# EAGLE design leicester_rev_A (EAGLE 6.6.0)
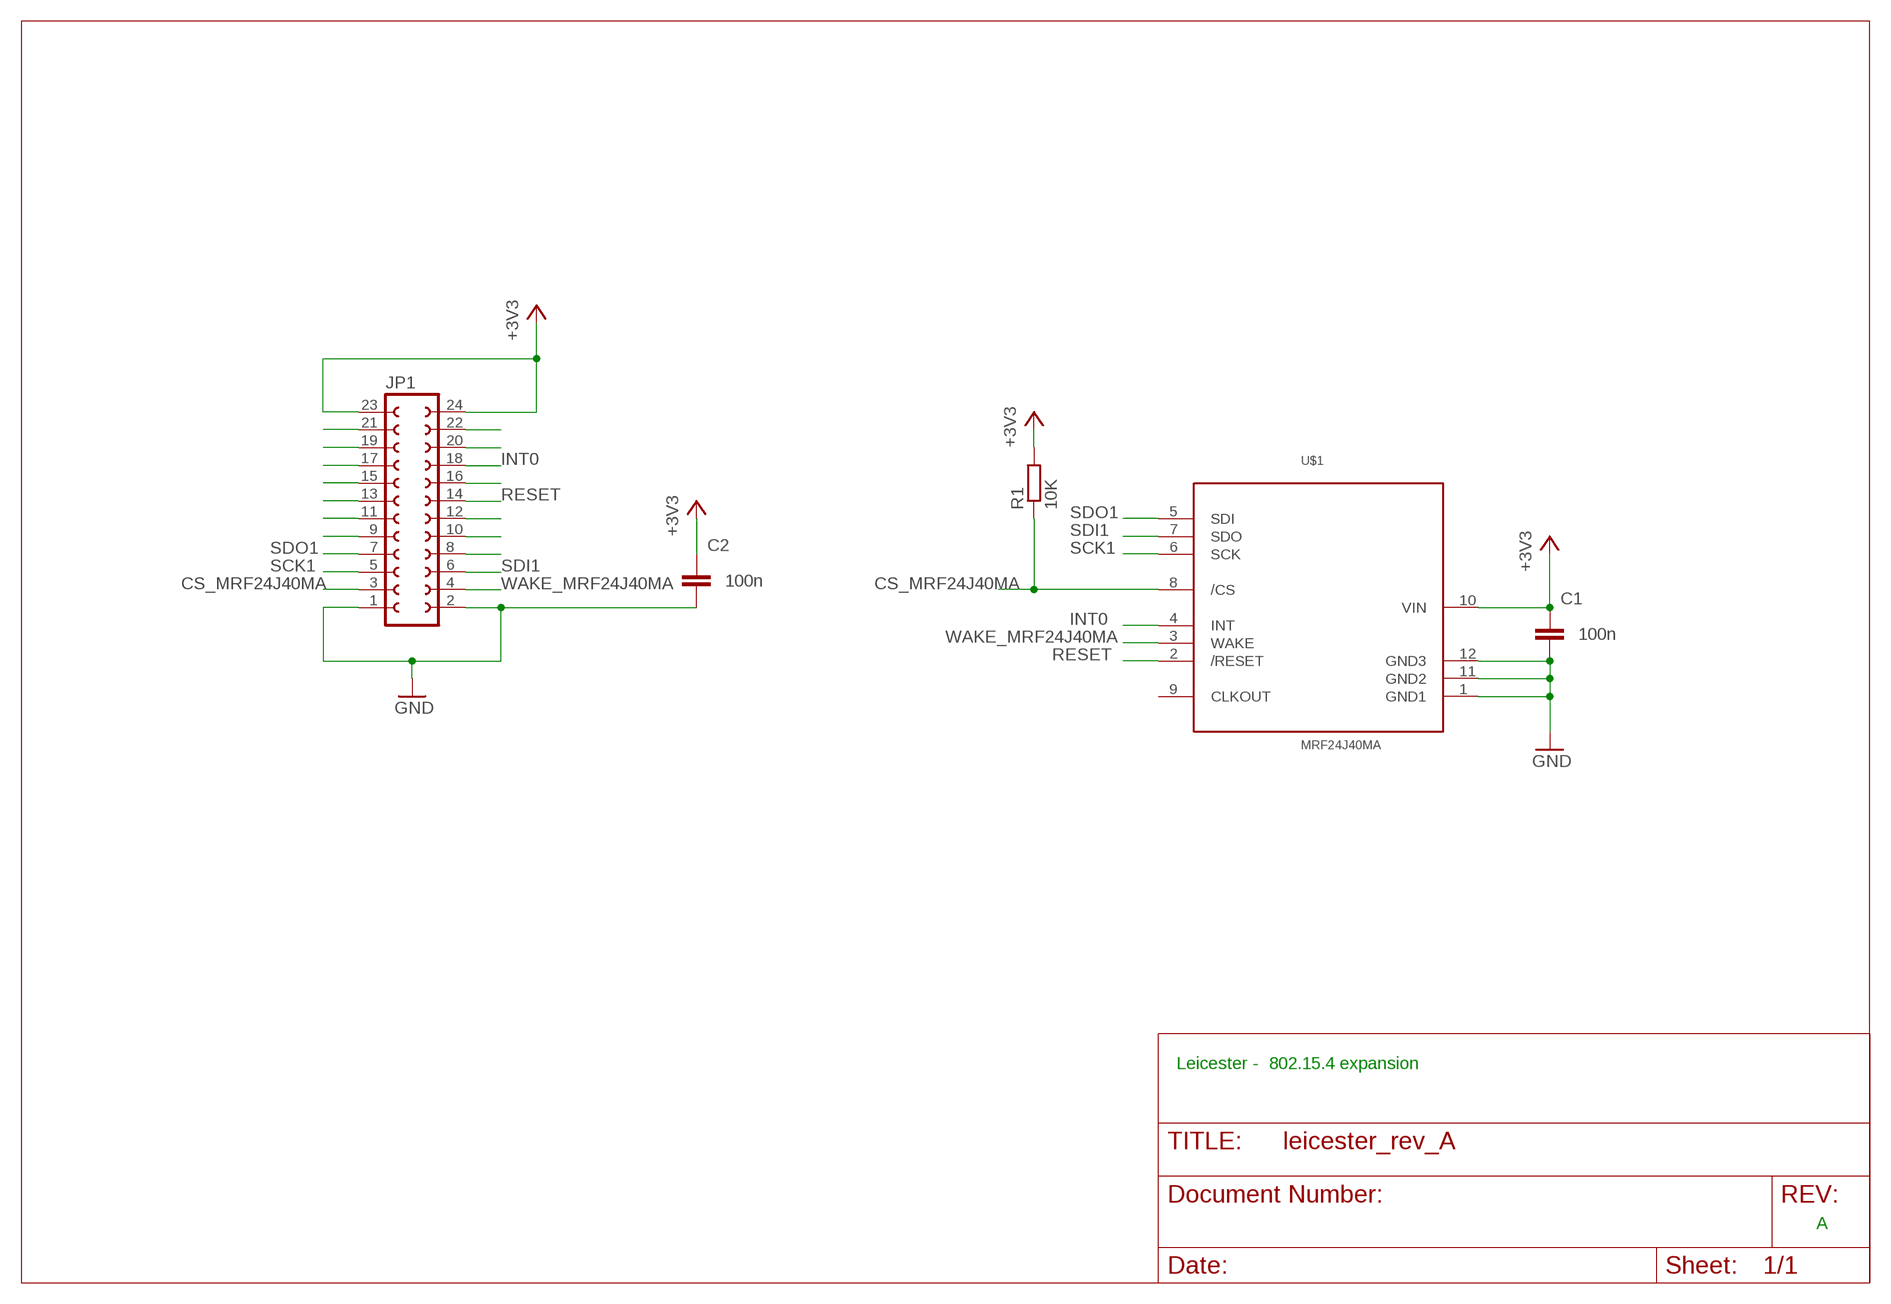
[diagram p0: schematic, sheet 1]

## Parts
C1  100n  C-EUC0805  [C0805]
C2  100n  C-EUC0805  [C0805]
JP1  FE12-2  [FE12-2]
R1  10K  R-EU_R0805  [R0805]
U$1  MRF24J40MA  [MRF24J40MA]

## Nets
+3V3: C1.1 C2.1 JP1.23 JP1.24 R1.2 U$1.10(VIN)
CS_MRF24J40MA: JP1.3 R1.1 U$1.8(/CS)
GND: C1.2 C2.2 JP1.1 JP1.2 U$1.1(GND1) U$1.11(GND2) U$1.12(GND3)
INT0: JP1.18 U$1.4(INT)
N$9: JP1.22
N$10: JP1.20
N$12: JP1.16
N$14: JP1.12
N$15: JP1.10
N$16: JP1.8
N$21: JP1.21
N$22: JP1.19
N$23: JP1.17
N$24: JP1.15
N$25: JP1.13
N$26: JP1.11
N$27: JP1.9
RESET: JP1.14 U$1.2(/RESET)
SCK1: JP1.5 U$1.6(SCK)
SDI1: JP1.6 U$1.7(SDO)
SDO1: JP1.7 U$1.5(SDI)
WAKE_MRF24J40MA: JP1.4 U$1.3(WAKE)
Unconnected: U$1.9(CLKOUT)

## Notes on the sheet
- Leicester -  802.15.4 expansion
- A

## Library data of the parts
C1 C2 = rcl:C-EU: CAPACITOR, European symbol
JP1 = con-lsta:FE12-2: FEMALE HEADER; OC_FARNELL: unknown; OC_NEWARK: unknown
R1 = rcl:R-EU_: RESISTOR, European symbol
U$1 = eurosource_mrf24j40ma:MRF24J40MA

## Board
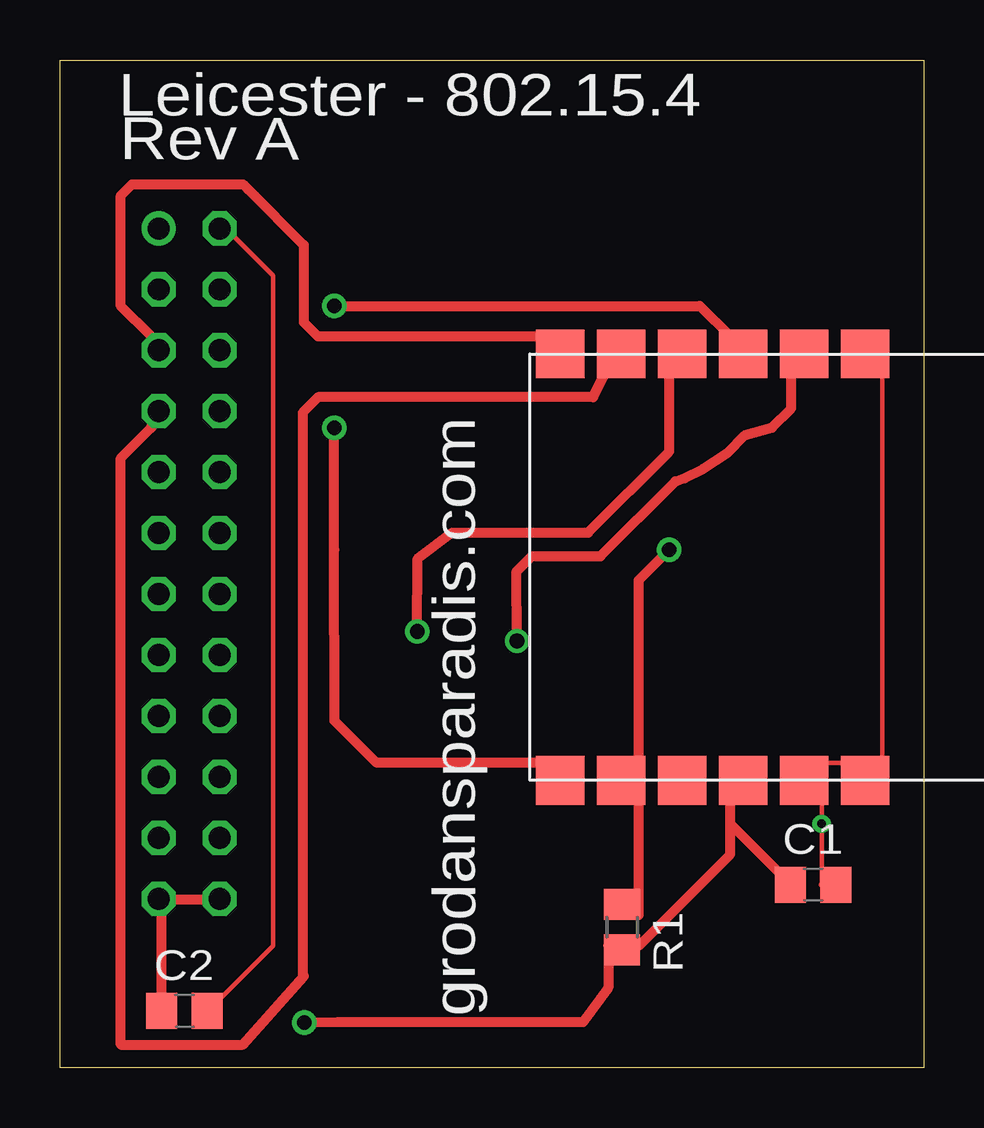
[diagram p1: board, top side]
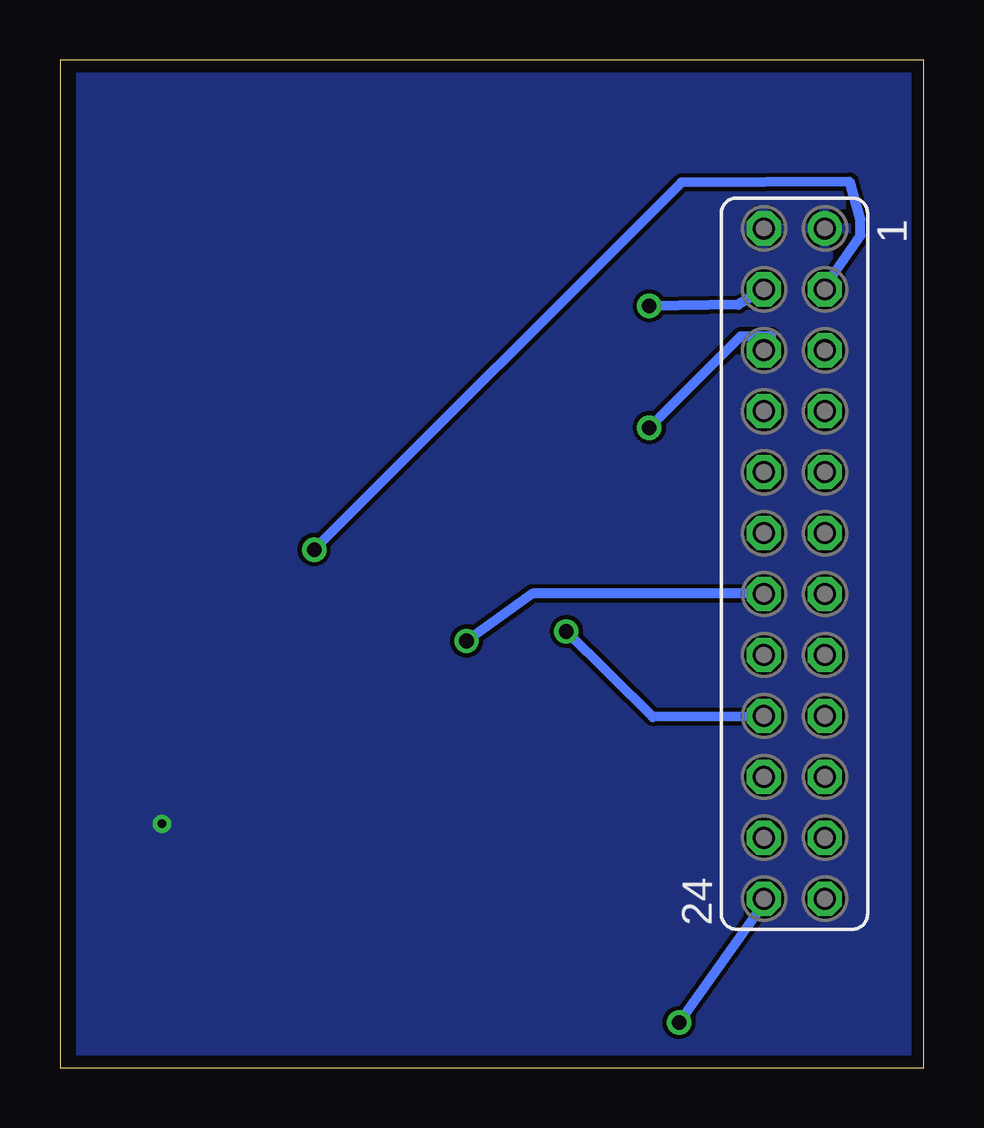
[diagram p2: board, bottom side, seen from below]

Size 36 x 42 mm. Coordinates in mm from the lower left corner, seen from the top.
Outline: 0,0 0,42 36,42 36,0 0,0
Copper layers (1*16): Top 0.0356mm / dielectric 1.5011mm / Bottom 0.0356mm
Design rules "SilverCircuits": minimum track width 7mil, minimum drill 14mil, track to track 7mil, track to pad 7mil, pad to pad 7mil, via to via 7mil, smd to smd 0mil, copper to edge 20mil, drill to drill 8mil, minimum pad ring 10mil, minimum via ring 8mil, stop-mask expansion 4mil, vias tented up to drill 0mil, thermal gap 10mil

### Footprints (pad centres in the part's own frame; a part is rotated, then mirrored left to right if it is on the bottom)
C0805 = smd 1.3 x 1.5: 1 -0.95,0; 2 0.95,0
FE12-2 = drill 0.914: 1 -13.97,1.27 | drill 0.914 octagon: 2 -13.97,-1.27; 3 -11.43,1.27; 4 -11.43,-1.27; 5 -8.89,1.27; 6 -8.89,-1.27; 7 -6.35,1.27; 8 -6.35,-1.27; 9 -3.81,1.27; 10 -3.81,-1.27; 11 -1.27,1.27; 12 -1.27,-1.27; 13 1.27,1.27; 14 1.27,-1.27; 15 3.81,1.27; 16 3.81,-1.27; 17 6.35,1.27; 18 6.35,-1.27; 19 8.89,1.27; 20 8.89,-1.27; 21 11.43,1.27; 22 11.43,-1.27; 23 13.97,1.27; 24 13.97,-1.27
R0805 = smd 1.3 x 1.5: 1 -0.95,0; 2 0.95,0
MRF24J40MA = smd 2.032 x 2.032: 1 -8.89,6.35; 2 -8.89,3.81; 3 -8.89,1.27; 4 -8.89,-1.27; 5 -8.89,-3.81; 6 -8.89,-6.35; 7 8.89,-6.35; 8 8.89,-3.81; 9 8.89,-1.27; 10 8.89,1.27; 11 8.89,3.81; 12 8.89,6.35

### Placement (x,y rotation side)
C1  31.4,7.62 0 top
C2  5.19,2.36 0 top
JP1  5.38,21.01 270 bottom
R1  23.43,5.85 270 top
U$1  27.21,20.86 270 top

### Tracks (layer width: path | path; a pad name or v marks a point on that pad's centre or on a via)
+3V3  (via drill 0.61)
  Top 0.254: 24.13,5.08 R1.2 22.86,5.08 | 27.94,11.43 U$1.10 | 30.48,7.62 C1.1
  Top 0.406: C2.1 4.24,7.04 JP1.23 4.12,7 6.67,7 JP1.24 | 24.13,5.08 27.94,8.89 27.94,10.16 | 27.94,10.16 27.94,11.43 | 27.94,10.16 30.48,7.62 | 22.86,5.08 22.86,3.33 21.81,1.89 11.58,1.89 v10.2,1.88
  Bottom 0.406: v10.2,1.88 6.56,6.98 JP1.24
CS_MRF24J40MA  (via drill 0.61)
  Top 0.254: R1.1 24.13,6.35 | 24.13,11.43 U$1.8 24.13,12.7
  Top 0.406: 24.13,6.35 24.13,11.43 | v25.4,21.59 24.13,20.32 24.13,12.7
  Bottom 0.406: v25.4,21.59 10.1,36.89 3.08,36.93 2.63,35.36 2.63,34.69 3.81,33.02 JP1.3
GND  (via drill 0.36)
  Top 0.178: 31.75,11.43 v31.75,10.16 31.75,7.62 | 33.02,12.7 31.75,12.7 | 34.29,12.7 34.29,29.21 | C2.2 6.35,2.54 8.89,5.08 8.89,33.02 6.35,35.56 JP1.2
  Top 0.254: 31.75,7.62 C1.2 | 31.75,11.43 U$1.11 31.75,12.7 | 33.02,12.7 U$1.12 34.29,12.7 | U$1.1 34.29,29.21
  pour Bottom: 0.28,41.29 0.25,41.29 0.25,0.08 34.33,0.39 35.37,0.54 35.11,0.62 35.11,42.52 0.51,42.07 0.51,40.95
INT0  (via drill 0.61)
  Top 0.254: 25.4,29.21 U$1.4
  Top 0.406: v14.89,18.18 14.91,21.21 16.34,22.3 22.02,22.3 25.4,25.68 25.4,29.21
  Bottom 0.406: v14.89,18.18 11.29,14.61 6.63,14.64 JP1.18
RESET  (via drill 0.61)
  Top 0.254: 30.48,29.21 U$1.2
  Top 0.406: v19.05,17.78 19.04,20.69 19.67,21.32 22.54,21.32 25.66,24.43 26.04,24.57 26.81,24.96 27.82,25.62 28.56,26.36 29.68,26.67 30.48,27.47 30.48,29.21
  Bottom 0.406: v19.05,17.78 16.3,19.76 6.59,19.76 JP1.14
SCK1
  Top 0.254: 7.62,36.83 7.84,36.61 | 20.32,30.48 U$1.6
  Top 0.406: JP1.5 3.81,30.48 2.54,31.75 2.54,36.35 3.01,36.82 7.63,36.82 7.84,36.61 10.16,34.29 10.16,31.07 10.74,30.49 20.31,30.49 20.32,30.48
SDI1  (via drill 0.61)
  Top 0.254: U$1.7 20.32,12.7
  Top 0.406: 20.32,12.7 13.2,12.7 11.45,14.46 11.43,21.59 v11.43,26.67
  Bottom 0.406: v11.43,26.67 7.62,30.48 6.35,30.48 JP1.6
SDO1
  Top 0.254: 22.86,29.21 U$1.5
  Top 0.406: 22.86,29.21 22.22,27.94 10.75,27.94 10.12,27.3 10.12,3.85 10.16,3.81 7.62,0.95 2.54,0.95 2.54,25.4 3.81,26.67 JP1.7
WAKE_MRF24J40MA  (via drill 0.61)
  Top 0.254: 27.94,30.48 U$1.3
  Top 0.406: 27.94,30.48 26.67,31.75 v11.43,31.75
  Bottom 0.254: JP1.4 6.59,32.46
  Bottom 0.406: v11.43,31.75 7.71,31.8 6.59,32.46

### Text on the board
tNames: Leicester - 802.15.4 | Rev A | grodansparadis.com